# Altium schematic sheet 点阵打印机.SchDoc
size A3
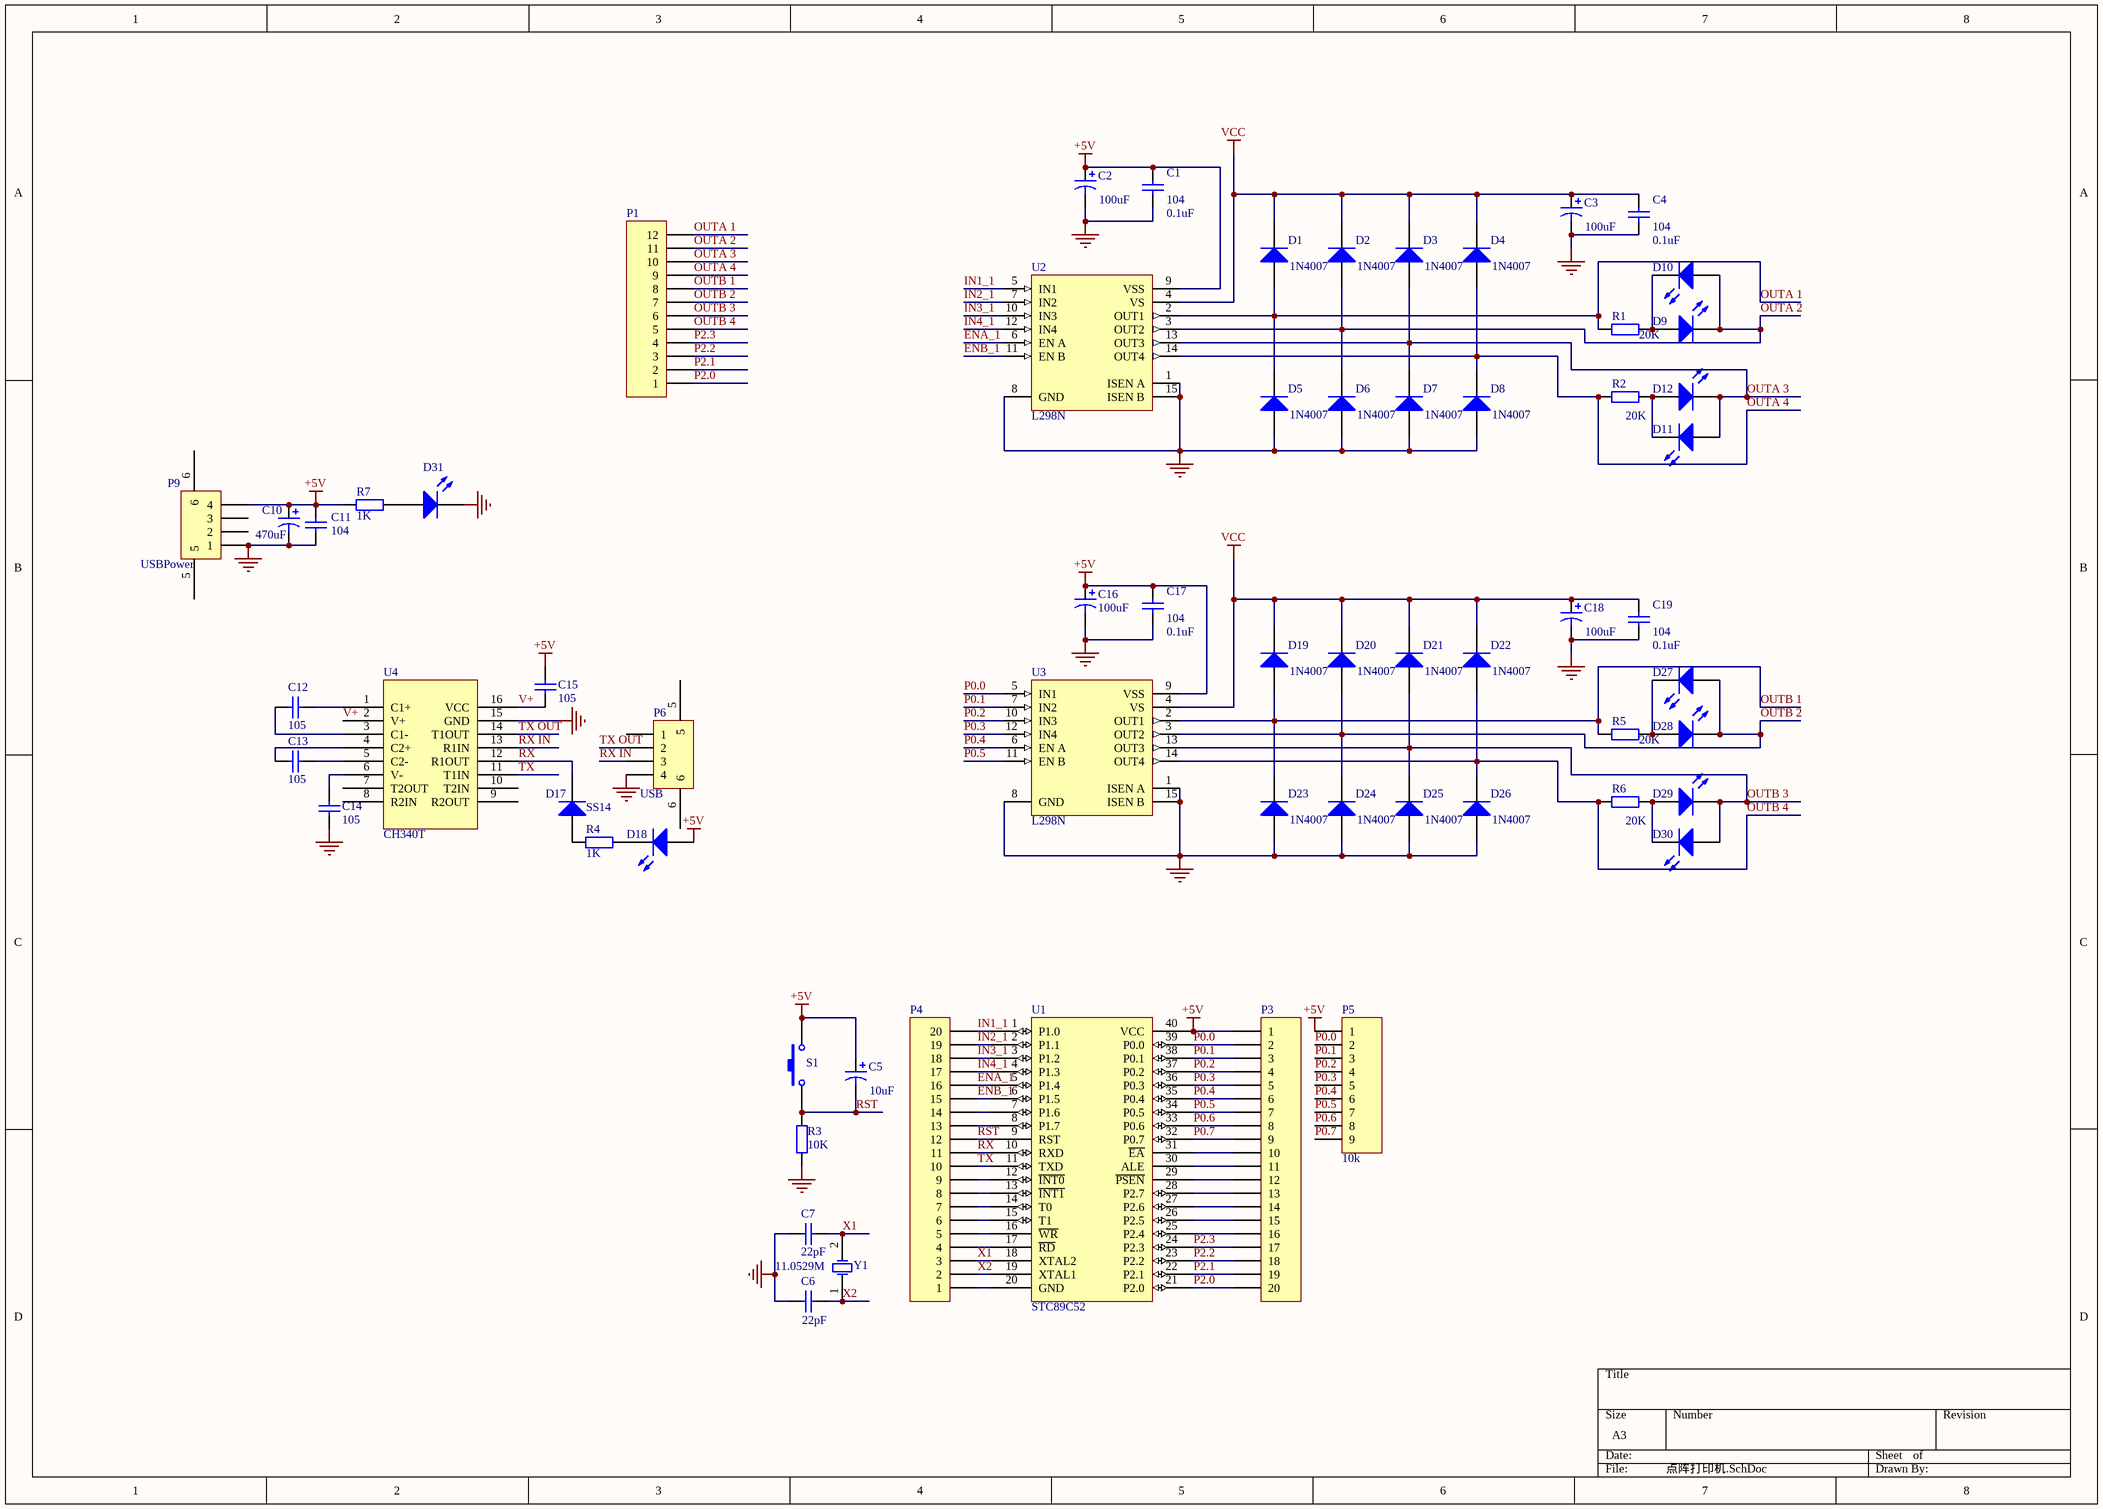
[diagram p0: 点阵打印机.SchDoc]

## Parts
C1  value 0.1uF  [CB2]  (hidden comment: Cap)
C2  value 100uF  [CD10]  (hidden comment: Cap Pol1)
C3  value 100uF  [CD10]  (hidden comment: Cap Pol1)
C4  value 0.1uF  [CB2]  (hidden comment: Cap)
C5  value 10uF  [CD10]  (hidden comment: Cap Pol1)
C6  value 22pF  [CB2]  (hidden comment: Cap)
C7  value 22pF  [CB2]  (hidden comment: Cap)
C10  value 470uF  [CD10]  (hidden comment: Cap Pol1)
C11  value 104  [CB2]  (hidden comment: Cap)
C12  value 105  [CB2]  (hidden comment: Cap)
C13  value 105  [CB2]  (hidden comment: Cap)
C14  value 105  [CB2]  (hidden comment: Cap)
C15  value 105  [CB2]  (hidden comment: Cap)
C16  value 100uF  [CD10]  (hidden comment: Cap Pol1)
C17  value 0.1uF  [CB2]  (hidden comment: Cap)
C18  value 100uF  [CD10]  (hidden comment: Cap Pol1)
C19  value 0.1uF  [CB2]  (hidden comment: Cap)
D1  1N4007  [DO-41]
D2  1N4007  [DO-41]
D3  1N4007  [DO-41]
D4  1N4007  [DO-41]
D5  1N4007  [DO-41]
D6  1N4007  [DO-41]
D7  1N4007  [DO-41]
D8  1N4007  [DO-41]
D9  LED0  [LED]  (value not drawn)
D10  LED0  [LED]  (value not drawn)
D11  LED0  [LED]  (value not drawn)
D12  LED0  [LED]  (value not drawn)
D17  SS14  [SMC]
D18  LED0  [LED]  (value not drawn)
D19  1N4007  [DO-41]
D20  1N4007  [DO-41]
D21  1N4007  [DO-41]
D22  1N4007  [DO-41]
D23  1N4007  [DO-41]
D24  1N4007  [DO-41]
D25  1N4007  [DO-41]
D26  1N4007  [DO-41]
D27  LED0  [LED]  (value not drawn)
D28  LED0  [LED]  (value not drawn)
D29  LED0  [LED]  (value not drawn)
D30  LED0  [LED]  (value not drawn)
D31  LED0  [LED]  (value not drawn)
P1  Header 12  [HDR1X12]  (value not drawn)
P3  Header 20  [HDR1X20]  (value not drawn)
P4  Header 20  [HDR1X20]  (value not drawn)
P5  10k  [HDR1X9]
P6  USB  [USB]
P9  USBPower  [USB]
R1  value 20K  [AXIAL-0.4]  (hidden comment: Res2)
R2  value 20K  [AXIAL-0.4]  (hidden comment: Res2)
R3  value 10K  [AXIAL-0.4]  (hidden comment: Res2)
R4  value 1K  [AXIAL-0.4]  (hidden comment: Res2)
R5  value 20K  [AXIAL-0.4]  (hidden comment: Res2)
R6  value 20K  [AXIAL-0.4]  (hidden comment: Res2)
R7  value 1K  [AXIAL-0.4]  (hidden comment: Res2)
S1  SW-PB  [KeyA]  (value not drawn)
U1  STC89C52  [STC89C52]
U2  L298N  [MULTIWATT15VA]
U3  L298N  [MULTIWATT15VA]
U4  CH340T  [MAX232CPE]
Y1  XTAL  [R38]  (value not drawn)

## Nets
+5V: C1.2 C2.1 C5.1 C10.1 C11.2 C15.2 C16.1 C17.2 D18.1(A) P3.1 P5.1 P9.4 R7.2 S1.2 U1.40(VCC) U2.9(VSS) U3.9(VSS)
GND: C1.1 C2.2 C3.2 C4.1 C6.1 C7.1 C10.2 C11.1 C14.1 C16.2 C17.1 C18.2 C19.1 D5.1(A) D6.1(A) D7.1(A) D8.1(A) D23.1(A) D24.1(A) D25.1(A) D26.1(A) D31.2(K) P6.4 P9.1 R3.2 U2.1(ISEN_A) U2.8(GND) U2.15(ISEN_B) U3.1(ISEN_A) U3.8(GND) U3.15(ISEN_B) U4.15(GND)
VCC: C3.1 C4.2 C18.1 C19.2 D1.2(K) D2.2(K) D3.2(K) D4.2(K) D19.2(K) D20.2(K) D21.2(K) D22.2(K) U2.4(VS) U3.4(VS)
ENA_1: P4.16 U1.5(P1.4) U2.6(EN_A)
ENB_1: P4.15 U1.6(P1.5) U2.11(EN_B)
IN1_1: P4.20 U1.1(P1.0) U2.5(IN1)
IN2_1: P4.19 U1.2(P1.1) U2.7(IN2)
IN3_1: P4.18 U1.3(P1.2) U2.10(IN3)
IN4_1: P4.17 U1.4(P1.3) U2.12(IN4)
OUTA 1: D1.1(A) D5.2(K) P1.12 R1.1 U2.2(OUT1)
OUTA 2: D2.1(A) D6.2(K) D9.2(K) D10.1(A) P1.11 U2.3(OUT2)
OUTA 3: D3.1(A) D7.2(K) D11.1(A) D12.2(K) P1.10 U2.13(OUT3)
OUTA 4: D4.1(A) D8.2(K) P1.9 R2.1 U2.14(OUT4)
OUTB 1: D19.1(A) D23.2(K) P1.8 R5.1 U3.2(OUT1)
OUTB 2: D20.1(A) D24.2(K) D27.1(A) D28.2(K) P1.7 U3.3(OUT2)
OUTB 3: D21.1(A) D25.2(K) D29.2(K) D30.1(A) P1.6 U3.13(OUT3)
OUTB 4: D22.1(A) D26.2(K) P1.5 R6.1 U3.14(OUT4)
P0.0: P3.2 P5.2 U1.39(P0.0) U3.5(IN1)
P0.1: P3.3 P5.3 U1.38(P0.1) U3.7(IN2)
P0.2: P3.4 P5.4 U1.37(P0.2) U3.10(IN3)
P0.3: P3.5 P5.5 U1.36(P0.3) U3.12(IN4)
P0.4: P3.6 P5.6 U1.35(P0.4) U3.6(EN_A)
P0.5: P3.7 P5.7 U1.34(P0.5) U3.11(EN_B)
P0.6: P3.8 P5.8 U1.33(P0.6)
P0.7: P3.9 P5.9 U1.32(P0.7)
P2.0: P1.1 P3.20 U1.21(P2.0)
P2.1: P1.2 P3.19 U1.22(P2.1)
P2.2: P1.3 P3.18 U1.23(P2.2)
P2.3: P1.4 P3.17 U1.24(P2.3)
RST: C5.2 P4.12 R3.1 S1.1 U1.9(RST)
RX: D17.2(K) P4.11 U1.10(RXD) U4.12(R1OUT)
RX IN: P6.3 U4.13(R1IN)
TX: P4.10 U1.11(TXD) U4.11(T1IN)
TX OUT: P6.2 U4.14(T1OUT)
V+: C15.1 U4.2(V+) U4.16(VCC)
X1: C7.2 P4.3 U1.18(XTAL2) Y1.2(OSC2)
X2: C6.2 P4.2 U1.19(XTAL1) Y1.1(OSC1)
NetC12_1: C12.1 U4.3(C1-)
NetC12_2: C12.2 U4.1(C1+)
NetC13_1: C13.1 U4.4(C2+)
NetC13_2: C13.2 U4.5(C2-)
NetC14_2: C14.2 U4.6(V-)
NetD9_1: D9.1(A) D10.2(K) R1.2
NetD11_2: D11.2(K) D12.1(A) R2.2
NetD17_1: D17.1(A) R4.1
NetD18_2: D18.2(K) R4.2
NetD27_2: D27.2(K) D28.1(A) R5.2
NetD29_1: D29.1(A) D30.2(K) R6.2
NetD31_1: D31.1(A) R7.1
NetP3_10: P3.10 U1.31(~{EA})
NetP3_11: P3.11 U1.30(ALE)
NetP3_12: P3.12 U1.29(~{PSEN})
NetP3_13: P3.13 U1.28(P2.7)
NetP3_14: P3.14 U1.27(P2.6)
NetP3_15: P3.15 U1.26(P2.5)
NetP3_16: P3.16 U1.25(P2.4)
NetP4_1: P4.1 U1.20(GND)
NetP4_4: P4.4 U1.17(~{RD})
NetP4_5: P4.5 U1.16(~{WR})
NetP4_6: P4.6 U1.15(T1)
NetP4_7: P4.7 U1.14(T0)
NetP4_8: P4.8 U1.13(~{INT1})
NetP4_9: P4.9 U1.12(~{INT0})
NetP4_13: P4.13 U1.8(P1.7)
NetP4_14: P4.14 U1.7(P1.6)

Not connected (* = marked no-connect by the designer): P6 1 5 6; P9 2 3 5 6; U4 7(T2OUT) 8(R2IN) 9(R2OUT) 10(T2IN)

## Notes on the sheet
- (in symbol Cap) 104
- (in symbol XTAL) 11.0529M

## Library data of the parts
C1 C4 C6 C7 C11-C15 C17 C19 = Cap: Capacitor; Published: 8-Jun-2000; LatestRevisionDate: 17-Jul-2002; LatestRevisionNote: Re-released for DXP Platform.; PackageReference: RAD-0.3; Publisher: Altium Limited
C2 C3 C5 C10 C16 C18 = Cap Pol1: Polarized Capacitor (Radial); Published: 8-Jun-2000; LatestRevisionDate: 17-Jul-2002; LatestRevisionNote: Re-released for DXP Platform.; PackageReference: RB7.6-15; Publisher: Altium Limited
D1-D8 D19-D26 = Diode 1N4007: 1 Amp General Purpose Rectifier; Published: 8-Jun-2000; LatestRevisionDate: 17-Jul-2002; LatestRevisionNote: Re-released for DXP Platform.; DatasheetDocument: 1998; PackageDocument: Aug-1999; PackageReference: DO-41; Publisher: Altium Limited; Code_JEDEC: DO-204-AL; ComponentLink1Description: Manufacturer Link; ComponentLink1URL: http://www.fairchildsemi.com/; ComponentLink2Description: Datasheet; ComponentLink2URL: http://www.fairchildsemi.com/ds/1N%2F1N4001.pdf
D9-D12 D18 D27-D31 = LED0: Typical INFRARED GaAs LED; Published: 8-Jun-2000; LatestRevisionDate: 08-Jul-2005; LatestRevisionNote: Mech Layer 1 removed.; PackageReference: LED-0; Publisher: Altium Limited
D17 = Diode: Default Diode; Published: 8-Jun-2000; LatestRevisionDate: 17-Jul-2002; LatestRevisionNote: Re-released for DXP Platform.; PackageDocument: Sep-1996; PackageReference: SMC; Publisher: Altium Limited; Code_JEDEC: DO-214-AB
P1 = Header 12: Header, 12-Pin; LatestRevisionDate: 17-Jul-2002; LatestRevisionNote: Re-released for DXP Platform.; Publisher: Altium Limited
P3 = Header 20: Header, 20-Pin; pin to pad: 1>20 2>19 3>18 4>17 5>16 6>15 7>14 8>13 9>12 10>11 11>10 12>9 13>8 14>7 15>6 16>5 17>4 18>3 19>2 20>1; LatestRevisionDate: 17-Jul-2002; LatestRevisionNote: Re-released for DXP Platform.; Publisher: Altium Limited
P4 = Header 20: Header, 20-Pin; LatestRevisionDate: 17-Jul-2002; LatestRevisionNote: Re-released for DXP Platform.; Publisher: Altium Limited
P5 = Header 9: Header, 9-Pin; pin to pad: 1>9 2>8 3>7 4>6 6>4 7>3 8>2 9>1; LatestRevisionDate: 17-Jul-2002; LatestRevisionNote: Re-released for DXP Platform.; Publisher: Altium Limited
P6 P9 = Header 4: Header, 4-Pin; LatestRevisionDate: 17-Jul-2002; LatestRevisionNote: Re-released for DXP Platform.; Publisher: Altium Limited
R1-R7 = Res2: Resistor; Published: 8-Jun-2000; LatestRevisionDate: 17-Jul-2002; LatestRevisionNote: Re-released for DXP Platform.; PackageReference: AXIAL-0.4; Publisher: Altium Limited
S1 = SW-PB: Switch; Published: 24-Mar-1999; LatestRevisionDate: 17-Jul-2002; LatestRevisionNote: Re-released for DXP Platform.; PackageReference: SPST-2; Publisher: Altium Limited
U2 U3 = L298N: High-Current Switching Regulator; Note: Specifications for the long lead horizontal Multiwatt package provided; Published: 24-Aug-2001; LatestRevisionDate: 17-Jul-2002; LatestRevisionNote: Re-released for DXP Platform.; DatasheetVersion: Apr-1993; PackageReference: MULTIWATT15VA; Publisher: Altium Limited; PackageDescription: TO, Thru-Hole, Vertical, Heatsink Mounted; 15 Bent Staggered Leads; Pitch 1.27 mm; ComponentLink1Description: Manufacturer Link; ComponentLink1URL: http://www.st.com/; ComponentLink2Description: Datasheet; ComponentLink2URL: http://www.st.com/stonline/products/literature/ds/1333/l296.pdf
U4 = MAX232CPE
Y1 = XTAL: Crystal Oscillator; pin to pad: 1>2 2>1; Published: 8-Jun-2000; LatestRevisionDate: 17-Jul-2002; LatestRevisionNote: Re-released for DXP Platform.; PackageReference: R38; Publisher: Altium Limited